# Altium project Fusebox.PrjPcb
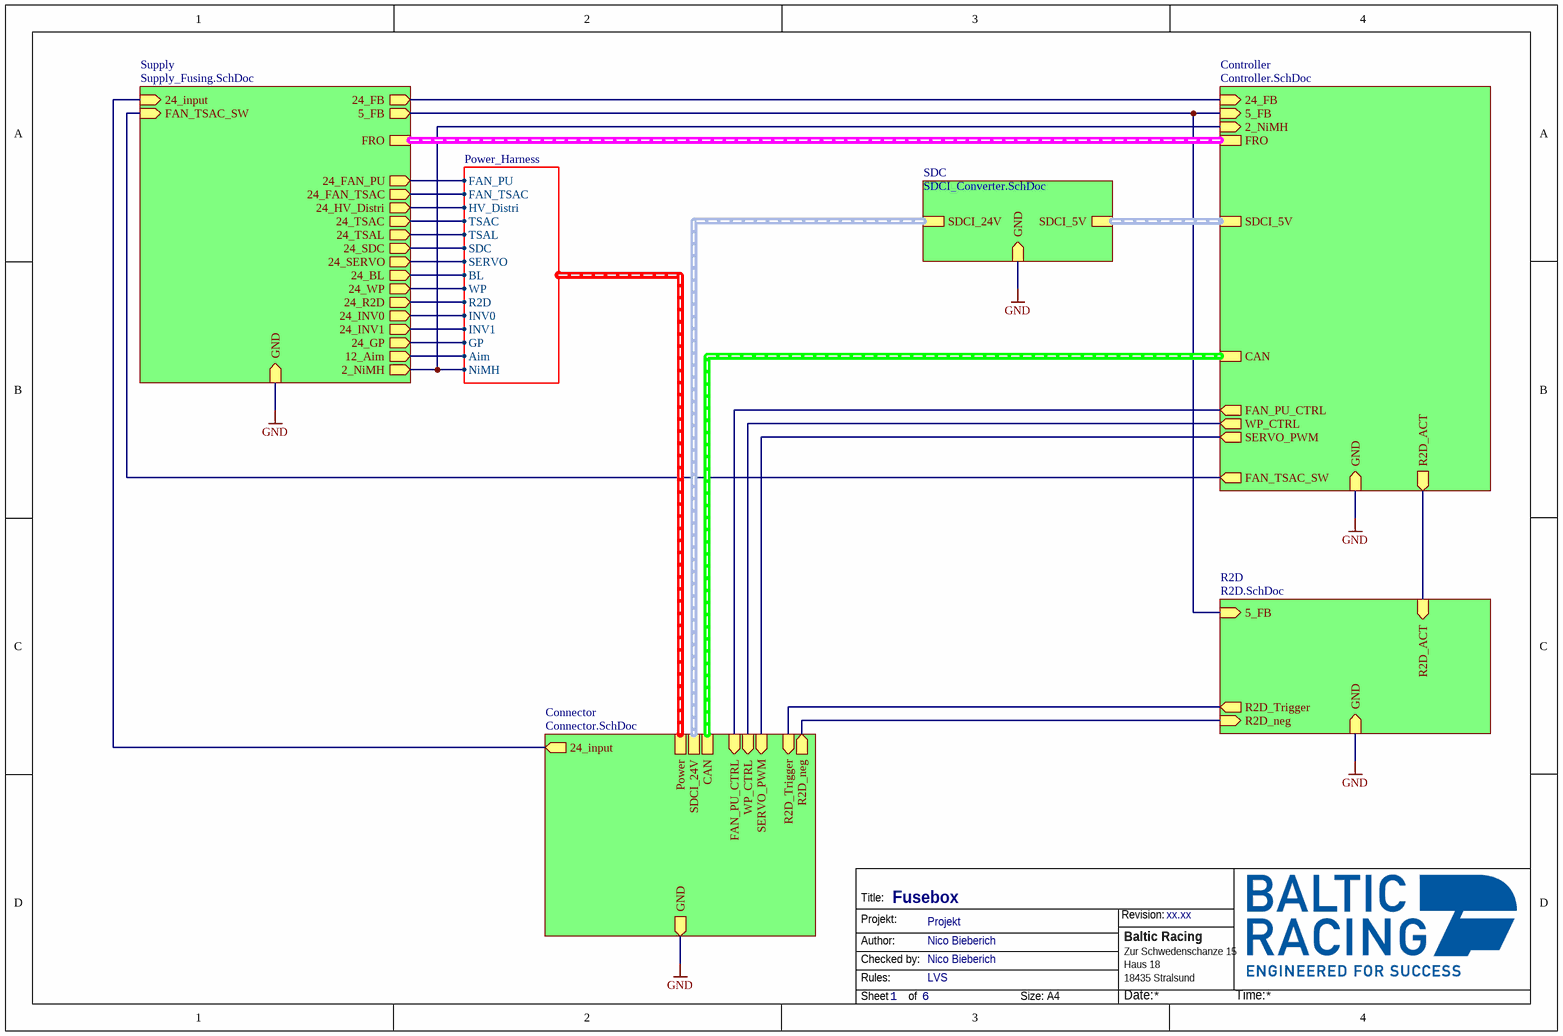
[diagram p0: Fusebox.SchDoc]
6 sheets, 121 parts. Net scope: hierarchical (ports join the sheet entries above them; power ports are global).
Board file: Fusebox_PCB.PcbDoc
Sheets:
  Fusebox.SchDoc
    Supply = Supply_Fusing.SchDoc
    Connector = Connector.SchDoc
    Controller = Controller.SchDoc
    R2D = R2D.SchDoc
    SDC = SDCI_Converter.SchDoc

## Sheet Fusebox.SchDoc: Fusebox
size A4; CheckedBy: Nico Bieberich; Author: Nico Bieberich; Organization: Baltic Racing; Address1: Zur Schwedenschanze 15; Address2: Haus 18; Address3: 18435 Stralsund; Revision: xx.xx; SheetNumber: 1; SheetTotal: 6; Rules: LVS; ProjectName: Projekt

### Sub-sheets
Connector = Connector.SchDoc: Power (harness Power_Harness), GND (out), SDCI_24V (harness SDCI_24V_Harness), 24_input (out), CAN (harness CAN_Harness), FAN_PU_CTRL (in), WP_CTRL (in), R2D_Trigger (in), SERVO_PWM (in), R2D_neg (out)
Controller = Controller.SchDoc: SDCI_5V (harness SDCI_5V_Harness), FRO (harness FRO_Harness), 5_FB (in), GND (in), CAN (harness CAN_Harness), 24_FB (in), 2_NiMH (in), FAN_TSAC_SW (out), FAN_PU_CTRL (out), WP_CTRL (out), R2D_ACT (out), SERVO_PWM (out)
R2D = R2D.SchDoc: R2D_ACT (in), GND (in), 5_FB (in), R2D_Trigger (out), R2D_neg (in)
SDC = SDCI_Converter.SchDoc: SDCI_5V (harness SDCI_5V_Harness), SDCI_24V (harness SDCI_24V_Harness), GND (in)
Supply = Supply_Fusing.SchDoc: 24_input (in), FAN_TSAC_SW (in), GND (in), 24_GP (out), 24_HV_Distri (out), 24_BL (out), 24_SDC (out), 24_FAN_TSAC (out), 24_FAN_PU (out), 24_WP (out), 24_TSAL (out), 24_TSAC (out), 24_INV0 (out), 24_INV1 (out), 24_FB (out), 12_Aim (out), 5_FB (out), 2_NiMH (out), FRO (harness FRO_Harness), 24_SERVO (out), 24_R2D (out)

### Harnesses
Power_Harness: GP, HV_Distri, BL, SDC, FAN_TSAC, FAN_PU, WP, TSAL, TSAC, INV0, INV1, Aim, NiMH, SERVO, R2D

### Nets
2_NiMH: sheet Supply/2_NiMH, sheet Controller/2_NiMH, sheet Connector/Power.NiMH
5V: sheet Supply/5_FB, sheet Controller/5_FB, sheet R2D/5_FB
24V: sheet Supply/24_FB, sheet Controller/24_FB
24V_input: sheet Supply/24_input, sheet Connector/24_input
GND: sheet Supply/GND, sheet Connector/GND, sheet Controller/GND, sheet R2D/GND, sheet SDC/GND
12_Aim: sheet Supply/12_Aim, sheet Connector/Power.Aim
24_BL: sheet Supply/24_BL, sheet Connector/Power.BL
24_FAN_PU: sheet Supply/24_FAN_PU, sheet Connector/Power.FAN_PU
24_FAN_TSAC: sheet Supply/24_FAN_TSAC, sheet Connector/Power.FAN_TSAC
24_GP: sheet Supply/24_GP, sheet Connector/Power.GP
24_HV_Distri: sheet Supply/24_HV_Distri, sheet Connector/Power.HV_Distri
24_INV0: sheet Supply/24_INV0, sheet Connector/Power.INV0
24_INV1: sheet Supply/24_INV1, sheet Connector/Power.INV1
24_R2D: sheet Supply/24_R2D, sheet Connector/Power.R2D
24_SDC: sheet Supply/24_SDC, sheet Connector/Power.SDC
24_SERVO: sheet Supply/24_SERVO, sheet Connector/Power.SERVO
24_TSAC: sheet Supply/24_TSAC, sheet Connector/Power.TSAC
24_TSAL: sheet Supply/24_TSAL, sheet Connector/Power.TSAL
24_WP: sheet Supply/24_WP, sheet Connector/Power.WP
FAN_PU_CTRL: sheet Connector/FAN_PU_CTRL, sheet Controller/FAN_PU_CTRL
FAN_TSAC_SW: sheet Supply/FAN_TSAC_SW, sheet Controller/FAN_TSAC_SW
R2D_neg: sheet Connector/R2D_neg, sheet R2D/R2D_neg
R2D_Trigger: sheet Connector/R2D_Trigger, sheet R2D/R2D_Trigger
Servo_PWM: sheet Connector/SERVO_PWM, sheet Controller/SERVO_PWM
WP_CTRL: sheet Connector/WP_CTRL, sheet Controller/WP_CTRL
NetJP2_1: sheet Controller/R2D_ACT, sheet R2D/R2D_ACT

### Buses and harness runs
harness sheet Connector/CAN = sheet Controller/CAN
harness sheet Connector/SDCI_24V = sheet SDC/SDCI_24V
harness sheet Controller/FRO = sheet Supply/FRO
harness sheet Controller/SDCI_5V = sheet SDC/SDCI_5V

### Notes on the sheet
- Title:
- Projekt:
- Revision:
- Author:
- Rules:
- Checked by:
- Sheet
- of
- Size:
- A4
- Date:
- Time:

## Sheet Supply_Fusing.SchDoc: Supply and Fusing
size A4; CheckedBy: Nico Bieberich; Author: Nico Bieberich; Organization: Baltic Racing; Address1: Zur Schwedenschanze 15; Address2: Haus 18; Address3: 18435 Stralsund; Revision: xx.xx; SheetNumber: 2; SheetTotal: 6; Rules: LVS
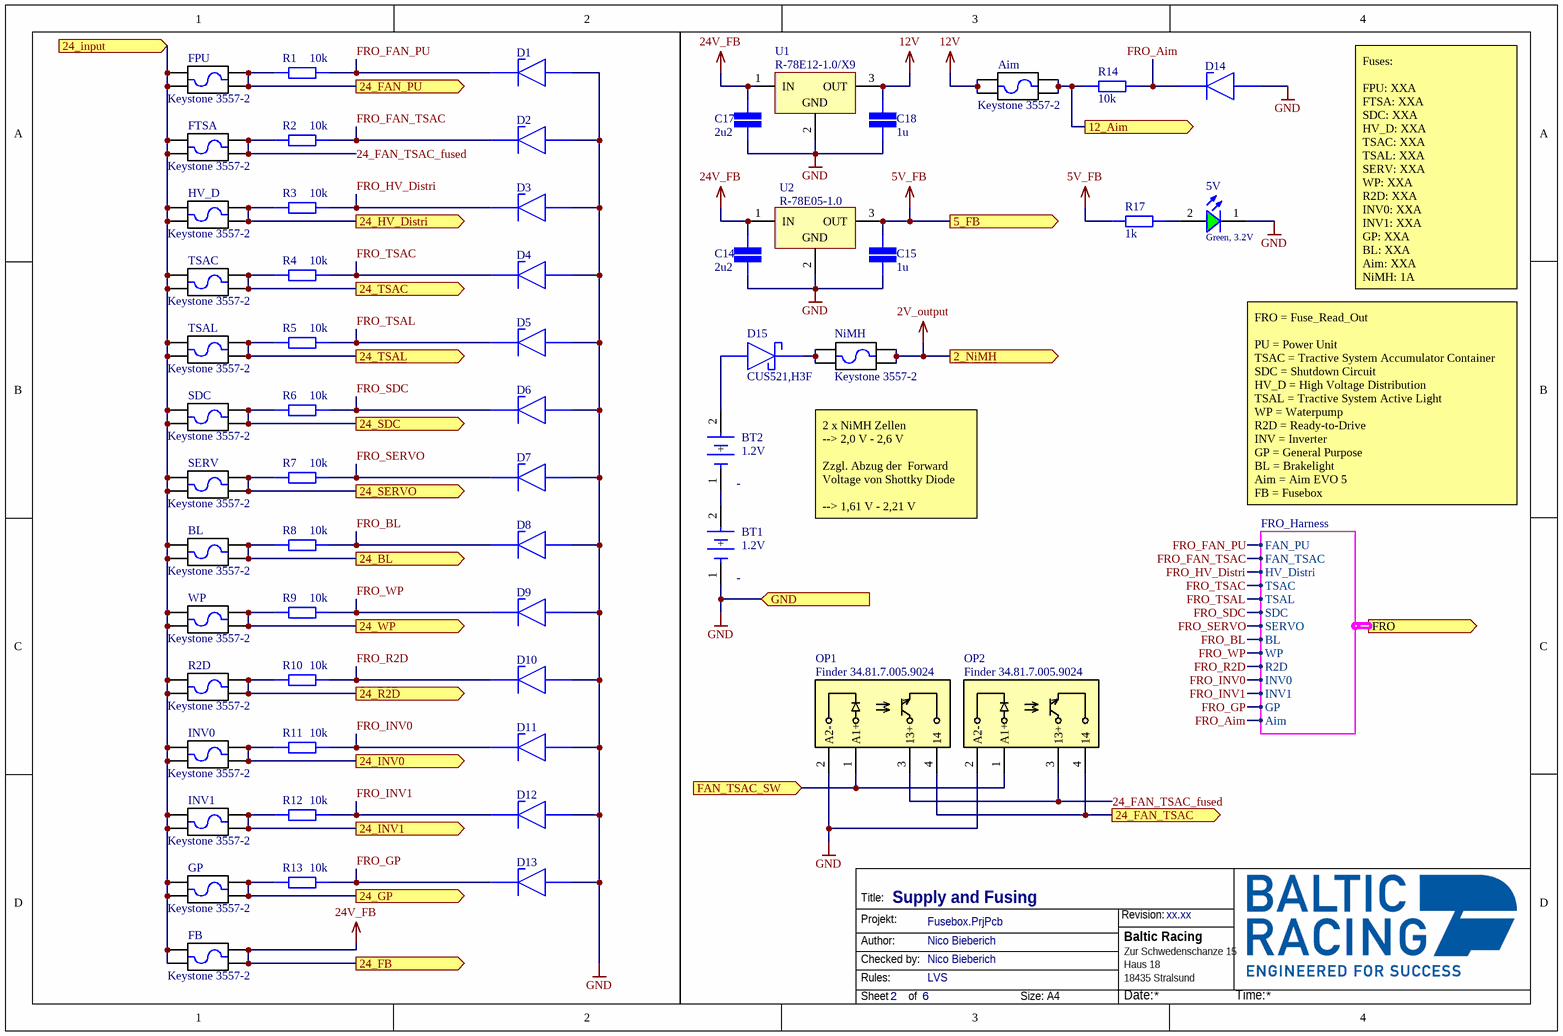
[diagram p1: Supply_Fusing.SchDoc]

### Parts
5V  Green, 3.2V  [WL-SMCW_0603_H=0.7mm]
Aim  Keystone 3557-2  [Keystone 3557-2]
BL  Keystone 3557-2  [Keystone 3557-2]
BT1  Voltage: 1.2V  [Keystone_1020_0]  (hidden comment: Keystone 1020)
BT2  Voltage: 1.2V  [Keystone_1020_0]  (hidden comment: Keystone 1020)
C14  value 2u2  [CAP 0603/1608]  (hidden comment: SMD Capacitor)
C15  value 1u  [CAP 0603/1608]  (hidden comment: SMD Capacitor)
C17  value 2u2  [CAP 0603/1608]  (hidden comment: SMD Capacitor)
C18  value 1u  [CAP 0603/1608]  (hidden comment: SMD Capacitor)
D1  MM3Z4V7T1G  [SOD-323-2]  (value not drawn)
D2  MM3Z4V7T1G  [SOD-323-2]  (value not drawn)
D3  MM3Z4V7T1G  [SOD-323-2]  (value not drawn)
D4  MM3Z4V7T1G  [SOD-323-2]  (value not drawn)
D5  MM3Z4V7T1G  [SOD-323-2]  (value not drawn)
D6  MM3Z4V7T1G  [SOD-323-2]  (value not drawn)
D7  MM3Z4V7T1G  [SOD-323-2]  (value not drawn)
D8  MM3Z4V7T1G  [SOD-323-2]  (value not drawn)
D9  MM3Z4V7T1G  [SOD-323-2]  (value not drawn)
D10  MM3Z4V7T1G  [SOD-323-2]  (value not drawn)
D11  MM3Z4V7T1G  [SOD-323-2]  (value not drawn)
D12  MM3Z4V7T1G  [SOD-323-2]  (value not drawn)
D13  MM3Z4V7T1G  [SOD-323-2]  (value not drawn)
D14  MM3Z4V7T1G  [SOD-323-2]  (value not drawn)
D15  CUS521,H3F  [SOD-323-2]
FB  Keystone 3557-2  [Keystone 3557-2]
FPU  Keystone 3557-2  [Keystone 3557-2]
FTSA  Keystone 3557-2  [Keystone 3557-2]
GP  Keystone 3557-2  [Keystone 3557-2]
HV_D  Keystone 3557-2  [Keystone 3557-2]
INV0  Keystone 3557-2  [Keystone 3557-2]
INV1  Keystone 3557-2  [Keystone 3557-2]
NiMH  Keystone 3557-2  [Keystone 3557-2]
OP1  Finder 34.81.7.005.9024  [Finder 34.81 Series]
OP2  Finder 34.81.7.005.9024  [Finder 34.81 Series]
R1  value 10k  [STACKPOLE CSR0603]  (hidden comment: SMD Resistor)
R2  value 10k  [STACKPOLE CSR0603]  (hidden comment: SMD Resistor)
R2D  Keystone 3557-2  [Keystone 3557-2]
R3  value 10k  [STACKPOLE CSR0603]  (hidden comment: SMD Resistor)
R4  value 10k  [STACKPOLE CSR0603]  (hidden comment: SMD Resistor)
R5  value 10k  [STACKPOLE CSR0603]  (hidden comment: SMD Resistor)
R6  value 10k  [STACKPOLE CSR0603]  (hidden comment: SMD Resistor)
R7  value 10k  [STACKPOLE CSR0603]  (hidden comment: SMD Resistor)
R8  value 10k  [STACKPOLE CSR0603]  (hidden comment: SMD Resistor)
R9  value 10k  [STACKPOLE CSR0603]  (hidden comment: SMD Resistor)
R10  value 10k  [STACKPOLE CSR0603]  (hidden comment: SMD Resistor)
R11  value 10k  [STACKPOLE CSR0603]  (hidden comment: SMD Resistor)
R12  value 10k  [STACKPOLE CSR0603]  (hidden comment: SMD Resistor)
R13  value 10k  [STACKPOLE CSR0603]  (hidden comment: SMD Resistor)
R14  value 10k  [STACKPOLE CSR0603]  (hidden comment: SMD Resistor)
R17  value 1k  [STACKPOLE CSR0603]  (hidden comment: SMD Resistor)
SDC  Keystone 3557-2  [Keystone 3557-2]
SERV  Keystone 3557-2  [Keystone 3557-2]
TSAC  Keystone 3557-2  [Keystone 3557-2]
TSAL  Keystone 3557-2  [Keystone 3557-2]
U1  R-78E12-1.0/X9  [SIP3_RECOM]
U2  R-78E05-1.0  [SIP3_RECOM]
WP  Keystone 3557-2  [Keystone 3557-2]

### Ports
2_NiMH (out), 5_FB (out), 12_Aim (out), 24_BL (out), 24_FAN_PU (out), 24_FAN_TSAC (out), 24_FB (out), 24_GP (out), 24_HV_Distri (out), 24_input (in), 24_INV0 (out), 24_INV1 (out), 24_R2D (out), 24_SDC (out), 24_SERVO (out), 24_TSAC (out), 24_TSAL (out), 24_WP (out), FAN_TSAC_SW (in), FRO (out, harness FRO_Harness), GND (in)

### Harnesses
FRO_Harness: GP, HV_Distri, BL, SDC, FAN_TSAC, FAN_PU, WP, TSAL, TSAC, INV0, INV1, Aim, SERVO, R2D

### Nets
2V_output: NiMH.O1 NiMH.O2 ; port 2_NiMH  [project net 2_NiMH]
5V_FB: C15.2 R17.2 U2.3(OUT) ; port 5_FB  [project net 5V]
12V: Aim.I1 Aim.I2 C18.2 U1.3(OUT)
24V_FB: C14.2 C17.2 FB.O1 FB.O2 U1.1(IN) U2.1(IN) ; port 24_FB  [project net 24V]
24V_input: BL.I1 BL.I2 FB.I1 FB.I2 FPU.I1 FPU.I2 FTSA.I1 FTSA.I2 GP.I1 GP.I2 HV_D.I1 HV_D.I2 INV0.I1 INV0.I2 INV1.I1 INV1.I2 R2D.I1 R2D.I2 SDC.I1 SDC.I2 SERV.I1 SERV.I2 TSAC.I1 TSAC.I2 TSAL.I1 TSAL.I2 WP.I1 WP.I2 ; port 24_input
GND: 5V.1(K) BT1.1(-) C14.1 C15.1 C17.1 C18.1 D1.2A(A) D2.2A(A) D3.2A(A) D4.2A(A) D5.2A(A) D6.2A(A) D7.2A(A) D8.2A(A) D9.2A(A) D10.2A(A) D11.2A(A) D12.2A(A) D13.2A(A) D14.2A(A) OP1.2(A2-) OP2.2(A2-) U1.2(GND) U2.2(GND) ; port GND
12_Aim: Aim.O1 Aim.O2 R14.2 ; port 12_Aim
24_BL: BL.O1 BL.O2 R8.2 ; port 24_BL
24_FAN_PU: FPU.O1 FPU.O2 R1.2 ; port 24_FAN_PU
24_FAN_TSAC: OP1.4(14) OP2.4(14) ; port 24_FAN_TSAC
24_FAN_TSAC_fused: FTSA.O1 FTSA.O2 OP1.3(13+) OP2.3(13+) R2.2
24_GP: GP.O1 GP.O2 R13.2 ; port 24_GP
24_HV_Distri: HV_D.O1 HV_D.O2 R3.2 ; port 24_HV_Distri
24_INV0: INV0.O1 INV0.O2 R11.2 ; port 24_INV0
24_INV1: INV1.O1 INV1.O2 R12.2 ; port 24_INV1
24_R2D: R2D.O1 R2D.O2 R10.2 ; port 24_R2D
24_SDC: R6.2 SDC.O1 SDC.O2 ; port 24_SDC
24_SERVO: R7.2 SERV.O1 SERV.O2 ; port 24_SERVO
24_TSAC: R4.2 TSAC.O1 TSAC.O2 ; port 24_TSAC
24_TSAL: R5.2 TSAL.O1 TSAL.O2 ; port 24_TSAL
24_WP: R9.2 WP.O1 WP.O2 ; port 24_WP
FAN_TSAC_SW: OP1.1(A1+) OP2.1(A1+) ; port FAN_TSAC_SW
FRO_Aim: D14.1C(C) R14.1 ; port FRO.Aim
FRO_BL: D8.1C(C) R8.1 ; port FRO.BL
FRO_FAN_PU: D1.1C(C) R1.1 ; port FRO.FAN_PU
FRO_FAN_TSAC: D2.1C(C) R2.1 ; port FRO.FAN_TSAC
FRO_GP: D13.1C(C) R13.1 ; port FRO.GP
FRO_HV_Distri: D3.1C(C) R3.1 ; port FRO.HV_Distri
FRO_INV0: D11.1C(C) R11.1 ; port FRO.INV0
FRO_INV1: D12.1C(C) R12.1 ; port FRO.INV1
FRO_R2D: D10.1C(C) R10.1 ; port FRO.R2D
FRO_SDC: D6.1C(C) R6.1 ; port FRO.SDC
FRO_SERVO: D7.1C(C) R7.1 ; port FRO.SERVO
FRO_TSAC: D4.1C(C) R4.1 ; port FRO.TSAC
FRO_TSAL: D5.1C(C) R5.1 ; port FRO.TSAL
FRO_WP: D9.1C(C) R9.1 ; port FRO.WP
Net5V_2: 5V.2(A) R17.1
NetBT1_2: BT1.2(+) BT2.1(-)
NetBT2_2: BT2.2(+) D15.2A(A)
NetD15_1C: D15.1C(C) NiMH.I1 NiMH.I2

### Notes on the sheet
- Fuses:
  FPU: XXA
  FTSA: XXA
  SDC: XXA
  HV_D: XXA
  TSAC: XXA
  TSAL: XXA
  SERV: XXA
  WP: XXA
  R2D: XXA
  INV0: XXA
  INV1: XXA
  GP: XXA
  BL: XXA
  Aim: XXA
  NiMH: 1A
- 2 x NiMH Zellen
  --> 2,0 V - 2,6 V
  Zzgl. Abzug der  Forward Voltage von Shottky Diode
  --> 1,61 V - 2,21 V
- FRO = Fuse_Read_Out
  PU = Power Unit
  TSAC = Tractive System Accumulator Container
  SDC = Shutdown Circuit
  HV_D = High Voltage Distribution
  TSAL = Tractive System Active Light
  WP = Waterpump
  R2D = Ready-to-Drive
  INV = Inverter
  GP = General Purpose
  BL = Brakelight
  Aim = Aim EVO 5
  FB = Fusebox
- Title:
- Projekt:
- Revision:
- Author:
- Rules:
- Checked by:
- Sheet
- of
- Size:
- A4
- Date:
- Time:

### Library data of the parts
5V = 150060GS75000: WL-SMCW SMT Mono-color Chip LED Waterclear, size 0603, Green, 3.2V, 140deg; Chip Technology: InGaN; Dominant Wavelength typ.: 525nm; Luminous Intensity typ.: 430mcd; Peak Wavelength typ.: 515nm; Viewing Angle: 140deg; ComponentLink1Description: Manufacturer; ComponentLink1URL: http://www.we-online.de; ComponentLink2URL: https://www.we-online.com/catalog/datasheet/150060GS75000.pdf; ComponentLink2Description: Datasheet; Forward Voltage typ.: 3.2V; Emitting Color: Green; Mounting Technology: SMT; Operating Temperature: -40 to +85degC; Published Date: December 2019; Part Number: 150060GS75000; Packaging: Tape and Reel; Size: 0603; Publisher: Wurth Elektronik
Aim BL FB FPU FTSA GP HV_D INV0 INV1 NiMH R2D SDC SERV TSAC TSAL WP = Keystone 3557-2: Keystone 3557-2 / Fuse Holder; ComponentLink1Description: Octopart; ComponentLink1URL: https://octopart.com/3557-2-keystone-850400?r=sp
BT1 BT2 = Keystone 1020: BATT HOLDER BATTERY AAA SMD; Part Number: 1020; helpURL: https://upverter.com/upn/revision/aeadfed39ba6ac98/; ComponentLink2Description: Datasheet; Temperature: -50°C to +145°C; Package: BT_HLDR_SMT; Supplier 2: Mouser; Price: 1.62889830371; Supplier 1: Digi-Key; ComponentLink1URL: https://upverter.com/upn/revision/aeadfed39ba6ac98/; Supplier Part Number 2: 534-1020; Supplier Part Number 1: 36-1020-ND; Manufacturer: Keystone; ComponentLink1Description: Upverter; ComponentLink2URL: http://www.keyelco.com/product-pdf.cfm?p=934; RoHS: TRUE; Mouser Part Number: 534-1020; Temperature Range High: +145°C; Digikey Description: BATT HOLDER BATTERY AAA SMD; Digikey Part Number: 36-1020-ND; Lead Free: yes; Temperature Range Low: -50°C
C14 C17 = SMD Capacitor: Capacitor with multiple Footprints; Voltage: 50
C15 C18 = SMD Capacitor: Capacitor with multiple Footprints; Voltage: 16
D1-D14 = MM3Z4V7T1G: onsemi MM3Z4V7T1G / Z-Diode, 4,7V; ComponentLink1Description: Octopart; ComponentLink1URL: https://octopart.com/mm3z4v7t1g-onsemi-331144?r=sp
D15 = CUS521,H3F: Toshiba CUS521,H3F / Shottky-Diode / Forward: 390mV, Reverse: 30V; ComponentLink1Description: Octopart; ComponentLink1URL: https://octopart.com/cus521%2Ch3f-toshiba-26712463?r=sp
OP1 OP2 = Finder 34.81 Series: Opto-Isolator / Finder 34.81 series; ComponentLink1Description: Finder; ComponentLink1URL: https://www.findernet.com/de/deutschland/series/serie-34-schmales-steck-printrelais-emr-oder-ssr-01-2-6a/
R1-R14 R17 = SMD Resistor: Resistor with multiple footprints; Power: 0.1W
U1 U2 = R-78E05-1.0: Nonisolated 5V Switchmode converter

## Sheet Connector.SchDoc: Connector
size A4; CheckedBy: Nico Bieberich; Author: Nico Bieberich; Organization: Baltic Racing; Address1: Zur Schwedenschanze 15; Address2: Haus 18; Address3: 18435 Stralsund; Revision: xx.xx; SheetNumber: 6; SheetTotal: 6; Rules: LVS
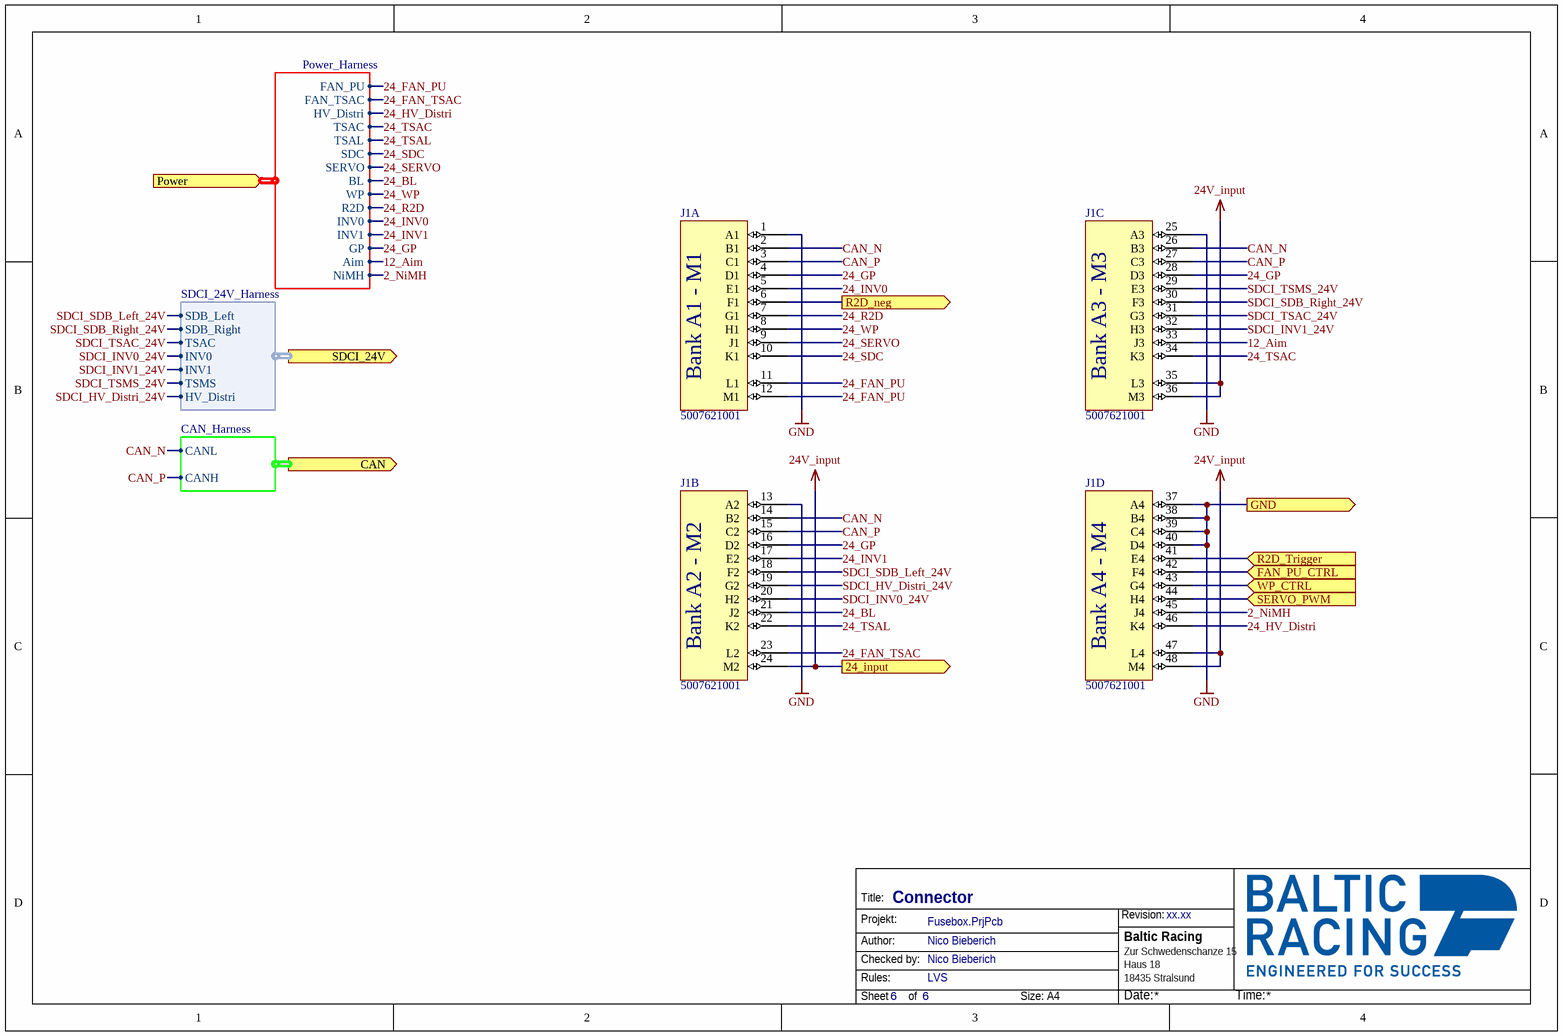
[diagram p2: Connector.SchDoc]

### Parts
J1  5007621001  [5007621001]  (parts A,B,C,D of 4)

### Ports
24_input (out), CAN (out, harness CAN_Harness), FAN_PU_CTRL (in), GND (out), Power (in, harness Power_Harness), R2D_neg (out), R2D_Trigger (in), SDCI_24V (out, harness SDCI_24V_Harness), SERVO_PWM (in), WP_CTRL (in)

### Harnesses
SDCI_24V_Harness: SDB_Left, SDB_Right, TSAC, INV0, INV1, TSMS, HV_Distri
CAN_Harness: CANL, CANH
Power_Harness: GP, HV_Distri, BL, SDC, FAN_TSAC, FAN_PU, WP, TSAL, TSAC, INV0, INV1, Aim, NiMH, SERVO, R2D

### Nets
2_NiMH: J1.45(J4) ; port Power.NiMH
24V_input: J1.24(M2) J1.35(L3) J1.36(M3) J1.47(L4) J1.48(M4) ; port 24_input
GND: J1.1(A1) J1.13(A2) J1.25(A3) J1.37(A4) J1.38(B4) J1.39(C4) J1.40(D4) ; port GND
12_Aim: J1.33(J3) ; port Power.Aim
24_BL: J1.21(J2) ; port Power.BL
24_FAN_PU: J1.11(L1) J1.12(M1) ; port Power.FAN_PU
24_FAN_TSAC: J1.23(L2) ; port Power.FAN_TSAC
24_GP: J1.4(D1) J1.16(D2) J1.28(D3) ; port Power.GP
24_HV_Distri: J1.46(K4) ; port Power.HV_Distri
24_INV0: J1.5(E1) ; port Power.INV0
24_INV1: J1.17(E2) ; port Power.INV1
24_R2D: J1.7(G1) ; port Power.R2D
24_SDC: J1.10(K1) ; port Power.SDC
24_SERVO: J1.9(J1) ; port Power.SERVO
24_TSAC: J1.34(K3) ; port Power.TSAC
24_TSAL: J1.22(K2) ; port Power.TSAL
24_WP: J1.8(H1) ; port Power.WP
CAN_N: J1.2(B1) J1.14(B2) J1.26(B3) ; port CAN.CANL
CAN_P: J1.3(C1) J1.15(C2) J1.27(C3) ; port CAN.CANH
FAN_PU_CTRL: J1.42(F4) ; port FAN_PU_CTRL
R2D_neg: J1.6(F1) ; port R2D_neg
R2D_Trigger: J1.41(E4) ; port R2D_Trigger
SDCI_HV_Distri_24V: J1.19(G2) ; port SDCI_24V.HV_Distri
SDCI_INV0_24V: J1.20(H2) ; port SDCI_24V.INV0
SDCI_INV1_24V: J1.32(H3) ; port SDCI_24V.INV1
SDCI_SDB_Left_24V: J1.18(F2) ; port SDCI_24V.SDB_Left
SDCI_SDB_Right_24V: J1.30(F3) ; port SDCI_24V.SDB_Right
SDCI_TSAC_24V: J1.31(G3) ; port SDCI_24V.TSAC
SDCI_TSMS_24V: J1.29(E3) ; port SDCI_24V.TSMS
Servo_PWM: J1.44(H4) ; port SERVO_PWM
WP_CTRL: J1.43(G4) ; port WP_CTRL

### Notes on the sheet
- Title:
- Projekt:
- Revision:
- Author:
- Rules:
- Checked by:
- Sheet
- of
- Size:
- A4
- Date:
- Time:
- (in symbol 5007621001, part A) Bank A1 - M1
- (in symbol 5007621001, part B) Bank A2 - M2
- (in symbol 5007621001, part C) Bank A3 - M3
- (in symbol 5007621001, part D) Bank A4 - M4

### Library data of the parts
J1 = 5007621001: Molex 5007621001 / 2.50mm, 3.50mm, 3.70mm CMC Header, Sealed, Right-Angle, 48 Circuits, Black; ComponentLink1Description: Molex; ComponentLink1URL: https://www.molex.com/en-us/products/part-detail/5007621001

## Sheet Controller.SchDoc: Controller
size A4; CheckedBy: Nico Bieberich; Author: Nico Bieberich; Organization: Baltic Racing; Address1: Zur Schwedenschanze 15; Address2: Haus 18; Address3: 18435 Stralsund; Revision: xx.xx; SheetNumber: 3; SheetTotal: 6; Rules: LVS; SPICEModelCacheCDSOYDZY: <root> / <DocumentId>CDSOYDZY</DocumentId> / <CacheFrame Number="0"> / <Model Name="0603_782631131_120ohm" Kind="CKT"> / <Text>******* / .subckt 0603_782631131_120ohm 1 2 / Rp 1 2 172 / Cp 1 2 0.545p / Rs 1 N3 0.12 / L1 N3 2 0.37u / .ends 0603_782631131_120ohm</Text> / </Model> / </CacheFrame> / </root>
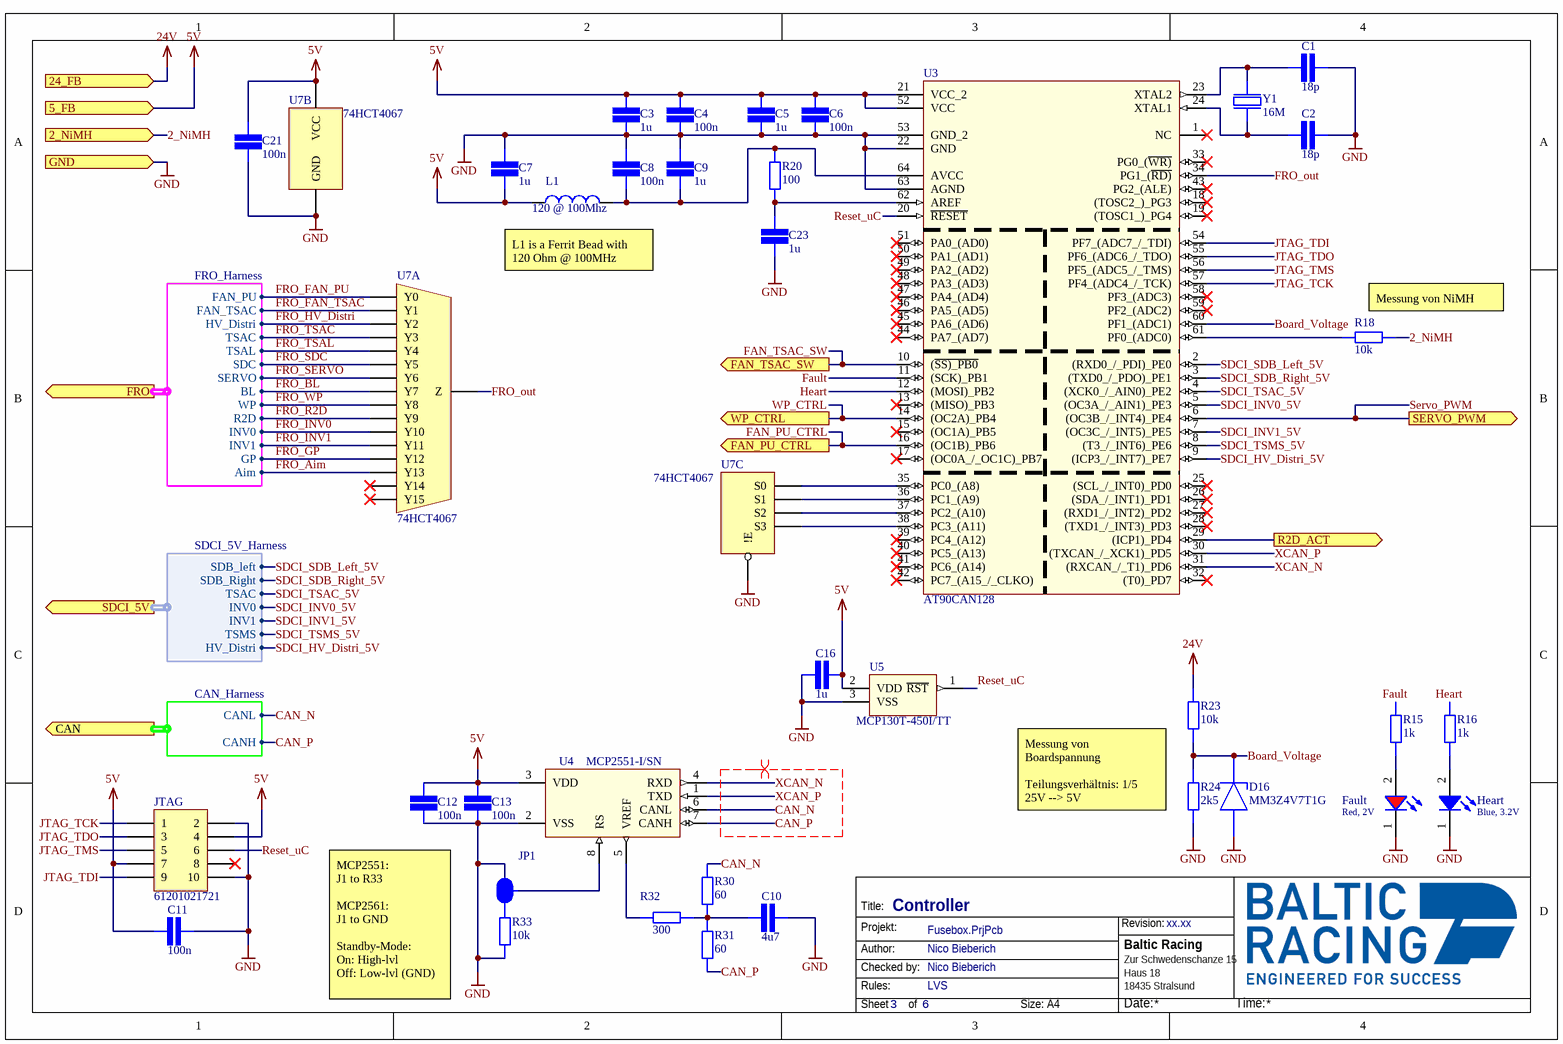
[diagram p3: Controller.SchDoc]

### Parts
C1  value 18p  [CAP 0603/1608]  (hidden comment: SMD Capacitor)
C2  value 18p  [CAP 0603/1608]  (hidden comment: SMD Capacitor)
C3  value 1u  [CAP 0603/1608]  (hidden comment: SMD Capacitor)
C4  value 100n  [CAP 0603/1608]  (hidden comment: SMD Capacitor)
C5  value 1u  [CAP 0603/1608]  (hidden comment: SMD Capacitor)
C6  value 100n  [CAP 0603/1608]  (hidden comment: SMD Capacitor)
C7  value 1u  [CAP 0603/1608]  (hidden comment: SMD Capacitor)
C8  value 100n  [CAP 0603/1608]  (hidden comment: SMD Capacitor)
C9  value 1u  [CAP 0603/1608]  (hidden comment: SMD Capacitor)
C10  value 4u7  [CAP 0603/1608]  (hidden comment: SMD Capacitor)
C11  value 100n  [CAP 0603/1608]  (hidden comment: SMD Capacitor)
C12  value 100n  [CAP 0603/1608]  (hidden comment: SMD Capacitor)
C13  value 100n  [CAP 0603/1608]  (hidden comment: SMD Capacitor)
C16  value 1u  [CAP 0603/1608]  (hidden comment: SMD Capacitor)
C21  value 100n  [CAP 0603/1608]  (hidden comment: SMD Capacitor)
C23  value 1u  [CAP 0603/1608]  (hidden comment: SMD Capacitor)
D16  MM3Z4V7T1G  [SOD-323-2]
Fault  Red, 2V  [WL-SMCW_0603_H=0.7mm]
Heart  Blue, 3.2V  [WL-SMCW_0603_H=0.7mm]
JP1  JUMPERID  [SMD-JUMPER-3]  (value not drawn)  (net tie, no BOM)
JTAG  61201021721  [61201021721]
L1  120 @ 100Mhz  [WE-CBA_0603_L1.6W0.8H0.8_HF/HS/WB]
R15  value 1k  [STACKPOLE CSR0603]  (hidden comment: SMD Resistor)
R16  value 1k  [STACKPOLE CSR0603]  (hidden comment: SMD Resistor)
R18  value 10k  [STACKPOLE CSR0603]  (hidden comment: SMD Resistor)
R20  value 100  [STACKPOLE CSR0603]  (hidden comment: SMD Resistor)
R23  value 10k  [STACKPOLE CSR0603]  (hidden comment: SMD Resistor)
R24  value 2k5  [STACKPOLE CSR0603]  (hidden comment: SMD Resistor)
R30  value 60  [STACKPOLE CSR0603]  (hidden comment: SMD Resistor)
R31  value 60  [STACKPOLE CSR0603]  (hidden comment: SMD Resistor)
R32  value 300  [STACKPOLE CSR0603]  (hidden comment: SMD Resistor)
R33  value 10k  [STACKPOLE CSR0603]  (hidden comment: SMD Resistor)
U3  AT90CAN128  [*QFP80P1600X1600X120-64N]
U4  MCP2551-I/SN  [*SOIC127P600X175-8N]
U5  MCP130T-450I/TT  [*SOT95P237X112-3N]
U7  74HCT4067  [74HCT4067PW]  (parts A,B,C of 3)
Y1  16M  [NDK NX5032GA]

### Ports
2_NiMH (in), 5_FB (in), 24_FB (in), CAN (out, harness CAN_Harness), FAN_PU_CTRL (out), FAN_TSAC_SW (out), FRO (out, harness FRO_Harness), GND (in), R2D_ACT (out), SDCI_5V (out, harness SDCI_5V_Harness), SERVO_PWM (out), WP_CTRL (out)

### Harnesses
SDCI_5V_Harness: SDB_left, SDB_Right, TSAC, INV0, INV1, TSMS, HV_Distri
CAN_Harness: CANL, CANH
FRO_Harness: GP, HV_Distri, BL, SDC, FAN_TSAC, FAN_PU, WP, TSAL, TSAC, INV0, INV1, Aim, SERVO, R2D

### Nets
2_NiMH: R18.2 ; port 2_NiMH
5V: C3.2 C4.2 C5.2 C6.2 C7.1 C11.2 C12.2 C13.2 C16.1 C21.2 JTAG.4 JTAG.7 L1.1 U3.21(VCC_2) U3.52(VCC) U4.3(VDD) U5.2(VDD) U7.24(VCC) ; port 5_FB
24V: R23.2 ; port 24_FB
GND: C1.1 C2.1 C3.1 C4.1 C5.1 C6.1 C7.2 C8.2 C9.2 C10.2 C11.1 C12.1 C13.1 C16.2 C21.1 C23.1 D16.2A(A) Fault.1(K) Heart.1(K) JP1.1 JTAG.2 JTAG.10 R24.1 R33.1 U3.22(GND) U3.53(GND_2) U3.63(AGND) U4.2(VSS) U5.3(VSS) U7.12(GND) U7.15(!E) ; port GND
Board_Voltage: D16.1C(C) R23.1 R24.2 U3.60(PF1_(ADC1))
CAN_N: R30.1 U4.6(CANL) ; port CAN.CANL
CAN_P: R31.2 U4.7(CANH) ; port CAN.CANH
FAN_PU_CTRL: U3.16((OC1B)_PB6) ; port FAN_PU_CTRL
FAN_TSAC_SW: U3.10((~{SS)_PB0}) ; port FAN_TSAC_SW
Fault: R15.1 U3.11((SCK)_PB1)
FRO_Aim: U7.18(Y13) ; port FRO.Aim
FRO_BL: U7.2(Y7) ; port FRO.BL
FRO_FAN_PU: U7.9(Y0) ; port FRO.FAN_PU
FRO_FAN_TSAC: U7.8(Y1) ; port FRO.FAN_TSAC
FRO_GP: U7.19(Y12) ; port FRO.GP
FRO_HV_Distri: U7.7(Y2) ; port FRO.HV_Distri
FRO_INV0: U7.21(Y10) ; port FRO.INV0
FRO_INV1: U7.20(Y11) ; port FRO.INV1
FRO_out: U3.34(PG1_(~{RD)}) U7.1(Z)
FRO_R2D: U7.22(Y9) ; port FRO.R2D
FRO_SDC: U7.4(Y5) ; port FRO.SDC
FRO_SERVO: U7.3(Y6) ; port FRO.SERVO
FRO_TSAC: U7.6(Y3) ; port FRO.TSAC
FRO_TSAL: U7.5(Y4) ; port FRO.TSAL
FRO_WP: U7.23(Y8) ; port FRO.WP
Heart: R16.1 U3.12((MOSI)_PB2)
JTAG_TCK: JTAG.1 U3.57(PF4_(ADC4_/_TCK))
JTAG_TDI: JTAG.9 U3.54(PF7_(ADC7_/_TDI))
JTAG_TDO: JTAG.3 U3.55(PF6_(ADC6_/_TDO))
JTAG_TMS: JTAG.5 U3.56(PF5_(ADC5_/_TMS))
Reset_uC: JTAG.6 U3.20(~{RESET}) U5.1(~{RST})
SDCI_HV_Distri_5V: U3.9((ICP3_/_INT7)_PE7) ; port SDCI_5V.HV_Distri
SDCI_INV0_5V: U3.5((OC3A_/_AIN1)_PE3) ; port SDCI_5V.INV0
SDCI_INV1_5V: U3.7((OC3C_/_INT5)_PE5) ; port SDCI_5V.INV1
SDCI_SDB_Left_5V: U3.2((RXD0_/_PDI)_PE0) ; port SDCI_5V.SDB_left
SDCI_SDB_Right_5V: U3.3((TXD0_/_PDO)_PE1) ; port SDCI_5V.SDB_Right
SDCI_TSAC_5V: U3.4((XCK0_/_AIN0)_PE2) ; port SDCI_5V.TSAC
SDCI_TSMS_5V: U3.8((T3_/_INT6)_PE6) ; port SDCI_5V.TSMS
Servo_PWM: U3.6((OC3B_/_INT4)_PE4) ; port SERVO_PWM
WP_CTRL: U3.14((OC2A)_PB4) ; port WP_CTRL
XCAN_N: U3.31((RXCAN_/_T1)_PD6) U4.4(RXD)
XCAN_P: U3.30((TXCAN_/_XCK1)_PD5) U4.1(TXD)
NetC1_2: C1.2 U3.23(XTAL2) Y1.2
NetC2_2: C2.2 U3.24(XTAL1) Y1.1
NetC8_1: C8.1 C9.1 L1.2 R20.2 U3.64(AVCC)
NetC10_1: C10.1 R30.2 R31.1 R32.2
NetC23_2: C23.2 R20.1 U3.62(AREF)
NetFault_2: Fault.2(A) R15.2
NetHeart_2: Heart.2(A) R16.2
NetJP1_2: JP1.2 U4.8(RS)
NetJP1_3: JP1.3 R33.2
NetJP2_1: U3.29((ICP1)_PD4) ; port R2D_ACT
NetR18_1: R18.1 U3.61(PF0_(ADC0))
NetR32_1: R32.1 U4.5(VREF)
NetU3_35: U3.35(PC0_(A8)) U7.10(S0)
NetU3_36: U3.36(PC1_(A9)) U7.11(S1)
NetU3_37: U3.37(PC2_(A10)) U7.14(S2)
NetU3_38: U3.38(PC3_(A11)) U7.13(S3)

Not connected (* = marked no-connect by the designer): JTAG 8*; U3 1(NC)* 13((MISO)_PB3)* 15((OC1A)_PB5)* 17((OC0A_/_OC1C)_PB7)* 18((TOSC2_)_PG3)* 19((TOSC1_)_PG4)* 25((SCL_/_INT0)_PD0)* 26((SDA_/_INT1)_PD1)* 27((RXD1_/_INT2)_PD2)* 28((TXD1_/_INT3)_PD3)* 32((T0)_PD7)* 33(PG0_(~{WR)})* 39(PC4_(A12))* 40(PC5_(A13))* 41(PC6_(A14))* 42(PC7_(A15_/_CLKO))* 43(PG2_(ALE))* 44(PA7_(AD7))* 45(PA6_(AD6))* 46(PA5_(AD5))* 47(PA4_(AD4))* 48(PA3_(AD3))* 49(PA2_(AD2))* 50(PA1_(AD1))* 51(PA0_(AD0))* 58(PF3_(ADC3))* 59(PF2_(ADC2))*; U7 16(Y15)* 17(Y14)*

### Layout directives
differential pair; differential pair class CAN_LINES; net class CAN: CAN_N, CAN_P, XCAN_N, XCAN_P

### Notes on the sheet
- (near L1) L1 is a Ferrit Bead with
  120 Ohm @ 100MHz
- (near R18) Messung von NiMH
- Messung von Boardspannung
  Teilungsverhältnis: 1/5
  25V --> 5V
- MCP2551:
  J1 to R33
  MCP2561:
  J1 to GND
  Standby-Mode:
  On: High-lvl
  Off: Low-lvl (GND)
- Title:
- Projekt:
- Revision:
- Author:
- Rules:
- Checked by:
- Sheet
- of
- Size:
- A4
- Date:
- Time:

### Library data of the parts
C1-C13 C16 C21 C23 = SMD Capacitor: as C15 on sheet Supply_Fusing
D16 = MM3Z4V7T1G: onsemi MM3Z4V7T1G / Z-Diode, 4,7V; ComponentLink1Description: Octopart; ComponentLink1URL: https://octopart.com/mm3z4v7t1g-onsemi-331144?r=sp
Fault = 150060RS75000: WL-SMCW SMT Mono-color Chip LED Waterclear, size 0603, Red, 2V, 140deg; Chip Technology: AlInGaP; Dominant Wavelength typ.: 625nm; Luminous Intensity typ.: 250mcd; Peak Wavelength typ.: 630nm; Viewing Angle: 140deg; ComponentLink1Description: Manufacturer; ComponentLink1URL: http://www.we-online.de; ComponentLink2URL: https://www.we-online.com/catalog/datasheet/150060RS75000.pdf; ComponentLink2Description: Datasheet; Forward Voltage typ.: 2V; Emitting Color: Red; Mounting Technology: SMT; Operating Temperature: -40 to +85degC; Published Date: December 2019; Part Number: 150060RS75000; Packaging: Tape and Reel; Size: 0603; Publisher: Wurth Elektronik
Heart = 150060BS75000: WL-SMCW SMT Mono-color Chip LED Waterclear, size 0603, Blue, 3.2V, 140deg; Chip Technology: InGaN; Dominant Wavelength typ.: 470nm; Luminous Intensity typ.: 145mcd; Peak Wavelength typ.: 465nm; Viewing Angle: 140deg; ComponentLink1Description: Manufacturer; ComponentLink1URL: http://www.we-online.de; ComponentLink2URL: https://www.we-online.com/catalog/datasheet/150060BS75000.pdf; ComponentLink2Description: Datasheet; Forward Voltage typ.: 3.2V; Emitting Color: Blue; Mounting Technology: SMT; Operating Temperature: -40 to +85degC; Published Date: December 2019; Part Number: 150060BS75000; Packaging: Tape and Reel; Size: 0603; Publisher: Wurth Elektronik
JP1 = SMD Jumper 3
JTAG = 61201021721: WR-BHD 2.54mm Male Angled Box Header; Manufacturer: Wurth Elektronik; ComponentLink1 Description: Manufacturer; ComponentLink2 Description: Datasheet; NoPins: 10; Created Date: March 2016; partNo: 61201021721; ComponentLink1URL: http://www.we-online.com; ComponentLink2URL: http://katalog.we-online.de/em/datasheet/6120xx21721.pdf; Created by: Baojun Chen
L1 = 782631131: WE-CBA SMT EMI Suppression Ferrite Bead, size 0603, 120Ohm, 0.5A; Manufacturer: Wurth Elektronik; Case/Size Code: 0603; DC Resistance Max: 0.12Ohm; Impedance Max: 200Ohm; Type: Wide Band; Manufacturer Part Number: 782631131; Category: Ferrites for PCB Assembly; Match Code: WE-CBA; ComponentLink1Description: Website Link; ComponentLink1URL: https://www.we-online.com/redexpert/article/782631131?ad; ComponentLink2Description: Datasheet Link; ComponentLink2URL: https://www.we-online.com/redexpert/spec/782631131?ad; Mount: Surface Mount; Operating Temperature Max: 125°C; Operating Temperature Min: -55°C; Packaging: Tape and Reel; Length: 1.6mm; Width: 0.8mm; Height: 0.8mm; Automotive: Yes; Impedance @100MHz: 120Ohm; Rated Current: 0.5A
R15 R16 R18 R20 R23 R24 R30-R33 = SMD Resistor: as R1 on sheet Supply_Fusing
U3 = AT90CAN128: Ic Mcu 8bit 128kb Flash 64tqfp; MP: AT90CAN128-16AI; MF: Microchip; Package: TQFP-64 Microchip; SnapEDA_Link: https://www.snapeda.com/parts/AT90CAN128-16AI/Microchip/view-part/?ref=snap; Price: None; Availability: Unavailable; Value: *
U4 = MCP2551-I/SN: MCP2551 Series 5.5 V 1 Mb/s Surface Mount High-Speed CAN Transceiver - SOIC-8; MF: Microchip; MP: MCP2551-I/SN; SnapEDA_Link: https://www.snapeda.com/parts/MCP2551-I/SN/Microchip/view-part/?ref=snap; Price: None; Package: SOIC-8 Microchip; Availability: Unavailable; Value: *
U5 = MCP130T-450I/TT: System Supervisors - Power Supply Monitors with Reset Generators Open Drain Low; MF: Microchip; MP: MCP120T-450I/TT; Price: None; SnapEDA_Link: https://www.snapeda.com/parts/MCP120T-450I/TT/Microchip/view-part/?ref=snap; Package: SOT-23-3 Microchip; Availability: Unavailable; Value: *
U7 = 74HCT4067: Nexperia 74HCT4067 / 16-channel analog multiplexer
Y1 = 16 MHz Quartz

## Sheet R2D.SchDoc: Ready-to-Drive Sound
size A4; CheckedBy: Nico Bieberich; Author: Nico Bieberich; Organization: Baltic Racing; Address1: Zur Schwedenschanze 15; Address2: Haus 18; Address3: 18435 Stralsund; Revision: xx.xx; SheetNumber: 5; SheetTotal: 6; Rules: LVS; ProjectName: Projekt
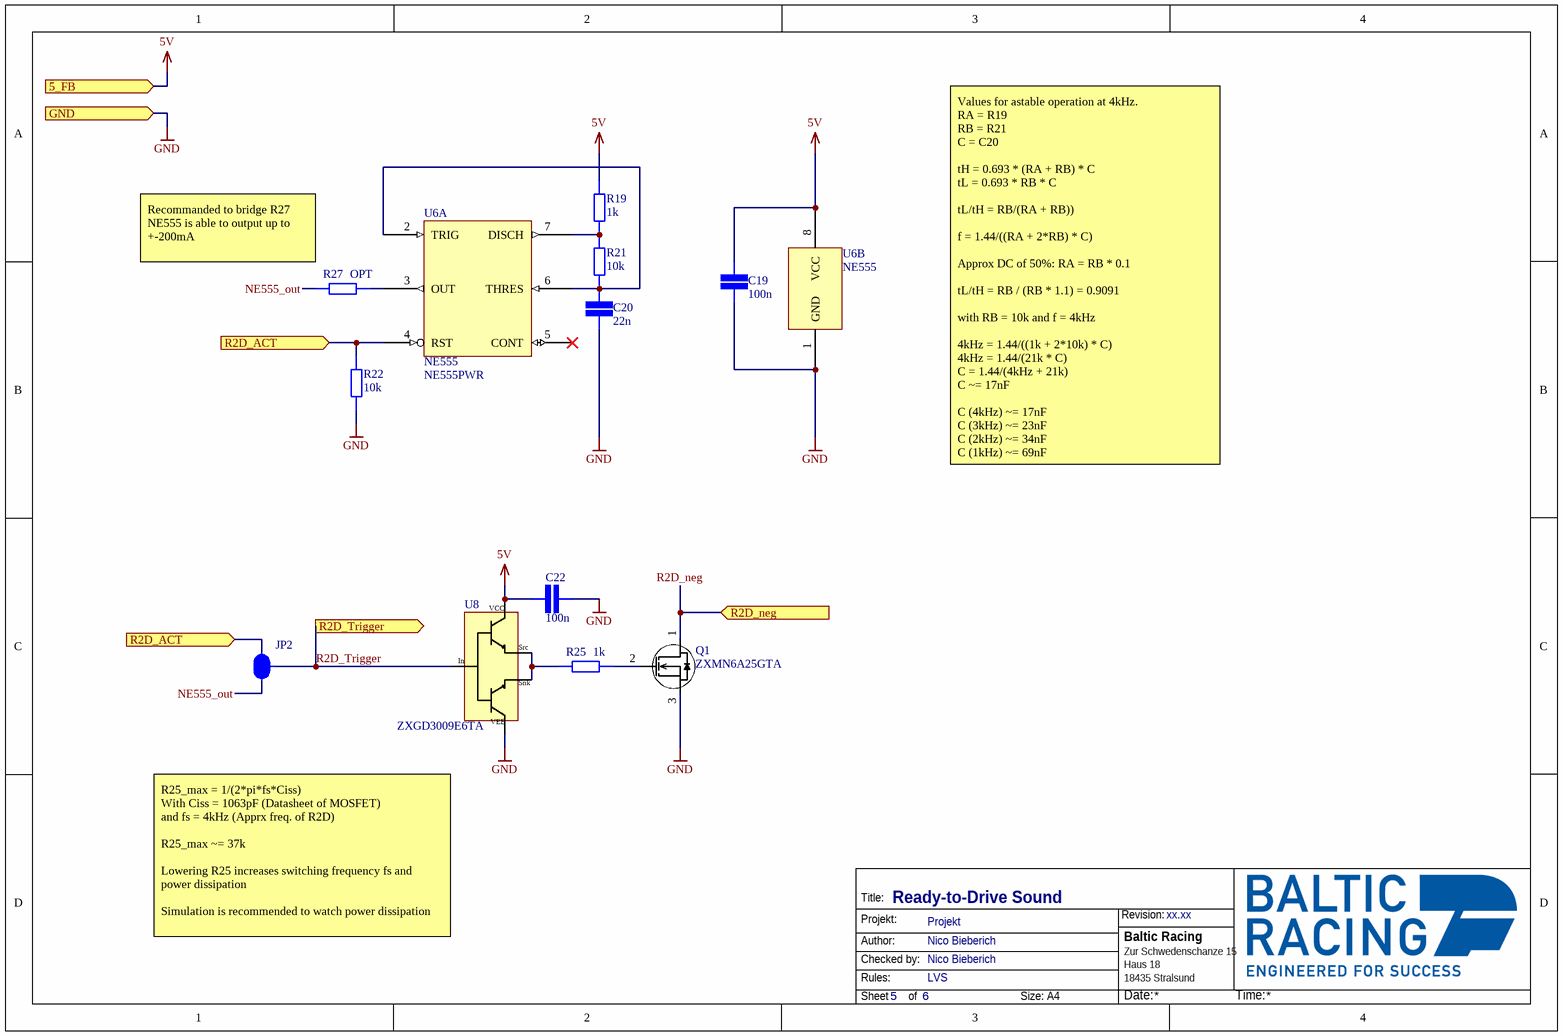
[diagram p4: R2D.SchDoc]

### Parts
C19  value 100n  [CAP 0603/1608]  (hidden comment: SMD Capacitor)
C20  value 22n  [CAP 0603/1608]  (hidden comment: SMD Capacitor)
C22  value 100n  [CAP 0603/1608]  (hidden comment: SMD Capacitor)
JP2  JUMPERID  [SMD-JUMPER-3]  (value not drawn)  (net tie, no BOM)
Q1  ZXMN6A25GTA  [ZXMN6A25GTA]
R19  value 1k  [STACKPOLE CSR0603]  (hidden comment: SMD Resistor)
R21  value 10k  [STACKPOLE CSR0603]  (hidden comment: SMD Resistor)
R22  value 10k  [STACKPOLE CSR0603]  (hidden comment: SMD Resistor)
R25  value 1k  [STACKPOLE CSR0603]  (hidden comment: SMD Resistor)
R27  value OPT  [STACKPOLE CSR0603]  (hidden comment: SMD Resistor)
U6  NE555  value NE555PWR  [NE555PWR]  (parts A,B of 2)
U8  ZXGD3009E6TA  [ZXGD3009E6TA]

### Ports
5_FB (in), GND (in), R2D_ACT (in), R2D_neg (in), R2D_Trigger (out)

### Nets
5V: C19.2 C22.1 R19.2 U6.8(VCC) U8.1(VCC) ; port 5_FB
GND: C19.1 C20.1 C22.2 Q1.3(S) R22.1 U6.1(GND) U8.3(VEE) ; port GND
NE555_out: JP2.3 R27.2
R2D_neg: Q1.1(D) ; port R2D_neg
R2D_Trigger: JP2.2 U8.2(In) ; port R2D_Trigger
NetC20_2: C20.2 R21.1 U6.2(TRIG) U6.6(THRES)
NetJP2_1: JP2.1 R22.2 U6.4(RST) ; port R2D_ACT
NetQ1_2: Q1.2(G) R25.1
NetR19_1: R19.1 R21.2 U6.7(DISCH)
NetR25_2: R25.2 U8.4(Snk) U8.6(Src)
NetR27_1: R27.1 U6.3(OUT)

Not connected (* = marked no-connect by the designer): U6 5(CONT)*

### Notes on the sheet
- (near R27) Recommanded to bridge R27
  NE555 is able to output up to +-200mA
- Values for astable operation at 4kHz.
  RA = R19
  RB = R21
  C = C20
  tH = 0.693 * (RA + RB) * C
  tL = 0.693 * RB * C
  tL/tH = RB/(RA + RB))
  f = 1.44/((RA + 2*RB) * C)
  Approx DC of 50%: RA = RB * 0.1
  tL/tH = RB / (RB * 1.1) = 0.9091
  with RB = 10k and f = 4kHz
  4kHz = 1.44/((1k + 2*10k) * C)
  4kHz = 1.44/(21k * C)
  C = 1.44/(4kHz + 21k)
  C ~= 17nF
  C (4kHz) ~= 17nF
  C (3kHz) ~= 23nF
  C (2kHz) ~= 34nF
  C (1kHz) ~= 69nF
- R25_max = 1/(2*pi*fs*Ciss)
  With Ciss = 1063pF (Datasheet of MOSFET)
  and fs = 4kHz (Apprx freq. of R2D)
  R25_max ~= 37k
  Lowering R25 increases switching frequency fs and power dissipation
  Simulation is recommended to watch power dissipation
- Title:
- Projekt:
- Revision:
- Author:
- Rules:
- Checked by:
- Sheet
- of
- Size:
- A4
- Date:
- Time:

### Library data of the parts
C19 C20 C22 = SMD Capacitor: as C15 on sheet Supply_Fusing
JP2 = SMD Jumper 3
Q1 = ZXMN6A25GTA: Diodes Inc. ZXMN6A25GTA / N-Channel MOSFET, 60V, 6.7A; ComponentLink1Description: Octopart; ComponentLink1URL: https://octopart.com/zxmn6a25gta-diodes+inc.-7519510?r=sp
R19 R21 R22 R25 R27 = SMD Resistor: as R1 on sheet Supply_Fusing
U6 = NE555: Single Precision Timer
U8 = ZXGD3009E6TA: Diodes Inc. ZXGD3009E6TA / MOSFET Gate Driver, 1Ch, 1A; ComponentLink1Description: Octopart; ComponentLink1URL: https://octopart.com/zxgd3009e6ta-diodes+inc.-49477954?r=sp

## Sheet SDCI_Converter.SchDoc: Shutdown Circuit Indicator
size A4; CheckedBy: Nico Bieberich; Author: Nico Bieberich; Organization: Baltic Racing; Address1: Zur Schwedenschanze 15; Address2: Haus 18; Address3: 18435 Stralsund; Revision: xx.xx; SheetNumber: 4; SheetTotal: 6; Rules: LVS; ProjectName: Projekt
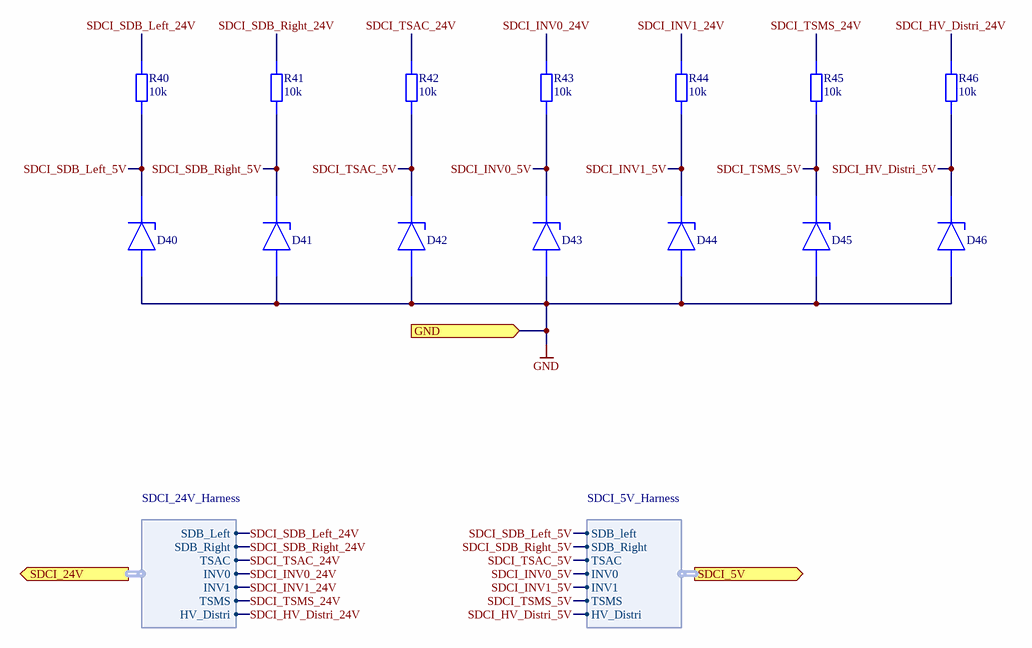
[diagram p5: SDCI_Converter.SchDoc]

### Parts
D40  MM3Z4V7T1G  [SOD-323-2]  (value not drawn)
D41  MM3Z4V7T1G  [SOD-323-2]  (value not drawn)
D42  MM3Z4V7T1G  [SOD-323-2]  (value not drawn)
D43  MM3Z4V7T1G  [SOD-323-2]  (value not drawn)
D44  MM3Z4V7T1G  [SOD-323-2]  (value not drawn)
D45  MM3Z4V7T1G  [SOD-323-2]  (value not drawn)
D46  MM3Z4V7T1G  [SOD-323-2]  (value not drawn)
R40  value 10k  [STACKPOLE CSR0603]  (hidden comment: SMD Resistor)
R41  value 10k  [STACKPOLE CSR0603]  (hidden comment: SMD Resistor)
R42  value 10k  [STACKPOLE CSR0603]  (hidden comment: SMD Resistor)
R43  value 10k  [STACKPOLE CSR0603]  (hidden comment: SMD Resistor)
R44  value 10k  [STACKPOLE CSR0603]  (hidden comment: SMD Resistor)
R45  value 10k  [STACKPOLE CSR0603]  (hidden comment: SMD Resistor)
R46  value 10k  [STACKPOLE CSR0603]  (hidden comment: SMD Resistor)

### Ports
GND (in), SDCI_5V (out, harness SDCI_5V_Harness), SDCI_24V (out, harness SDCI_24V_Harness)

### Harnesses
SDCI_5V_Harness: SDB_left, SDB_Right, TSAC, INV0, INV1, TSMS, HV_Distri
SDCI_24V_Harness: SDB_Left, SDB_Right, TSAC, INV0, INV1, TSMS, HV_Distri

### Nets
GND: D40.2A(A) D41.2A(A) D42.2A(A) D43.2A(A) D44.2A(A) D45.2A(A) D46.2A(A) ; port GND
SDCI_HV_Distri_5V: D46.1C(C) R46.1 ; port SDCI_5V.HV_Distri
SDCI_HV_Distri_24V: R46.2 ; port SDCI_24V.HV_Distri
SDCI_INV0_5V: D43.1C(C) R43.1 ; port SDCI_5V.INV0
SDCI_INV0_24V: R43.2 ; port SDCI_24V.INV0
SDCI_INV1_5V: D44.1C(C) R44.1 ; port SDCI_5V.INV1
SDCI_INV1_24V: R44.2 ; port SDCI_24V.INV1
SDCI_SDB_Left_5V: D40.1C(C) R40.1 ; port SDCI_5V.SDB_left
SDCI_SDB_Left_24V: R40.2 ; port SDCI_24V.SDB_Left
SDCI_SDB_Right_5V: D41.1C(C) R41.1 ; port SDCI_5V.SDB_Right
SDCI_SDB_Right_24V: R41.2 ; port SDCI_24V.SDB_Right
SDCI_TSAC_5V: D42.1C(C) R42.1 ; port SDCI_5V.TSAC
SDCI_TSAC_24V: R42.2 ; port SDCI_24V.TSAC
SDCI_TSMS_5V: D45.1C(C) R45.1 ; port SDCI_5V.TSMS
SDCI_TSMS_24V: R45.2 ; port SDCI_24V.TSMS

### Notes on the sheet
- Title:
- Projekt:
- Revision:
- Author:
- Rules:
- Checked by:
- Sheet
- of
- Size:
- A4
- Date:
- Time:

### Library data of the parts
D40-D46 = MM3Z4V7T1G: onsemi MM3Z4V7T1G / Z-Diode, 4,7V; ComponentLink1Description: Octopart; ComponentLink1URL: https://octopart.com/mm3z4v7t1g-onsemi-331144?r=sp
R40-R46 = SMD Resistor: as R1 on sheet Supply_Fusing

## Nets that join several sheets
2_NiMH: Supply_Fusing (NiMH.O1 NiMH.O2), Connector (J1.45), Controller (R18.2)
5V: Supply_Fusing (C15.2 R17.2 U2.3), Controller (18 pins), R2D (5 pins)
24V: Supply_Fusing (6 pins), Controller (R23.2)
24V_input: Supply_Fusing (28 pins), Connector (5 pins)
GND: Supply_Fusing (24 pins), Connector (7 pins), Controller (31 pins), R2D (7 pins), SDCI_Converter (7 pins)
12_Aim: Supply_Fusing (Aim.O1 Aim.O2 R14.2), Connector (J1.33)
24_BL: Supply_Fusing (BL.O1 BL.O2 R8.2), Connector (J1.21)
24_FAN_PU: Supply_Fusing (FPU.O1 FPU.O2 R1.2), Connector (J1.11 J1.12)
24_FAN_TSAC: Supply_Fusing (OP1.4 OP2.4), Connector (J1.23)
24_GP: Supply_Fusing (GP.O1 GP.O2 R13.2), Connector (J1.4 J1.16 J1.28)
24_HV_Distri: Supply_Fusing (HV_D.O1 HV_D.O2 R3.2), Connector (J1.46)
24_INV0: Supply_Fusing (INV0.O1 INV0.O2 R11.2), Connector (J1.5)
24_INV1: Supply_Fusing (INV1.O1 INV1.O2 R12.2), Connector (J1.17)
24_R2D: Supply_Fusing (R2D.O1 R2D.O2 R10.2), Connector (J1.7)
24_SDC: Supply_Fusing (R6.2 SDC.O1 SDC.O2), Connector (J1.10)
24_SERVO: Supply_Fusing (R7.2 SERV.O1 SERV.O2), Connector (J1.9)
24_TSAC: Supply_Fusing (R4.2 TSAC.O1 TSAC.O2), Connector (J1.34)
24_TSAL: Supply_Fusing (R5.2 TSAL.O1 TSAL.O2), Connector (J1.22)
24_WP: Supply_Fusing (R9.2 WP.O1 WP.O2), Connector (J1.8)
CAN_N: Connector (J1.2 J1.14 J1.26), Controller (R30.1 U4.6)
CAN_P: Connector (J1.3 J1.15 J1.27), Controller (R31.2 U4.7)
FAN_PU_CTRL: Connector (J1.42), Controller (U3.16)
FAN_TSAC_SW: Supply_Fusing (OP1.1 OP2.1), Controller (U3.10)
FRO_Aim: Supply_Fusing (D14.1C R14.1), Controller (U7.18)
FRO_BL: Supply_Fusing (D8.1C R8.1), Controller (U7.2)
FRO_FAN_PU: Supply_Fusing (D1.1C R1.1), Controller (U7.9)
FRO_FAN_TSAC: Supply_Fusing (D2.1C R2.1), Controller (U7.8)
FRO_GP: Supply_Fusing (D13.1C R13.1), Controller (U7.19)
FRO_HV_Distri: Supply_Fusing (D3.1C R3.1), Controller (U7.7)
FRO_INV0: Supply_Fusing (D11.1C R11.1), Controller (U7.21)
FRO_INV1: Supply_Fusing (D12.1C R12.1), Controller (U7.20)
FRO_R2D: Supply_Fusing (D10.1C R10.1), Controller (U7.22)
FRO_SDC: Supply_Fusing (D6.1C R6.1), Controller (U7.4)
FRO_SERVO: Supply_Fusing (D7.1C R7.1), Controller (U7.3)
FRO_TSAC: Supply_Fusing (D4.1C R4.1), Controller (U7.6)
FRO_TSAL: Supply_Fusing (D5.1C R5.1), Controller (U7.5)
FRO_WP: Supply_Fusing (D9.1C R9.1), Controller (U7.23)
NetJP2_1: Controller (U3.29), R2D (JP2.1 R22.2 U6.4)
R2D_neg: Connector (J1.6), R2D (Q1.1)
R2D_Trigger: Connector (J1.41), R2D (JP2.2 U8.2)
SDCI_HV_Distri_5V: Controller (U3.9), SDCI_Converter (D46.1C R46.1)
SDCI_HV_Distri_24V: Connector (J1.19), SDCI_Converter (R46.2)
SDCI_INV0_5V: Controller (U3.5), SDCI_Converter (D43.1C R43.1)
SDCI_INV0_24V: Connector (J1.20), SDCI_Converter (R43.2)
SDCI_INV1_5V: Controller (U3.7), SDCI_Converter (D44.1C R44.1)
SDCI_INV1_24V: Connector (J1.32), SDCI_Converter (R44.2)
SDCI_SDB_Left_5V: Controller (U3.2), SDCI_Converter (D40.1C R40.1)
SDCI_SDB_Left_24V: Connector (J1.18), SDCI_Converter (R40.2)
SDCI_SDB_Right_5V: Controller (U3.3), SDCI_Converter (D41.1C R41.1)
SDCI_SDB_Right_24V: Connector (J1.30), SDCI_Converter (R41.2)
SDCI_TSAC_5V: Controller (U3.4), SDCI_Converter (D42.1C R42.1)
SDCI_TSAC_24V: Connector (J1.31), SDCI_Converter (R42.2)
SDCI_TSMS_5V: Controller (U3.8), SDCI_Converter (D45.1C R45.1)
SDCI_TSMS_24V: Connector (J1.29), SDCI_Converter (R45.2)
Servo_PWM: Connector (J1.44), Controller (U3.6)
WP_CTRL: Connector (J1.43), Controller (U3.14)